# EasyEDA Pro project osc_gener.eprj, schematic 示波发生

## Sheets
1 主板＋ad: Create Date: 2025-03-17; Page Name: 主板＋ad; Project Name: osc_gener; Schematic Name: 示波发生; Update Date: 2026-05-22; Company: 嘉立创EDA; Page Size: A4; Version: V1.0
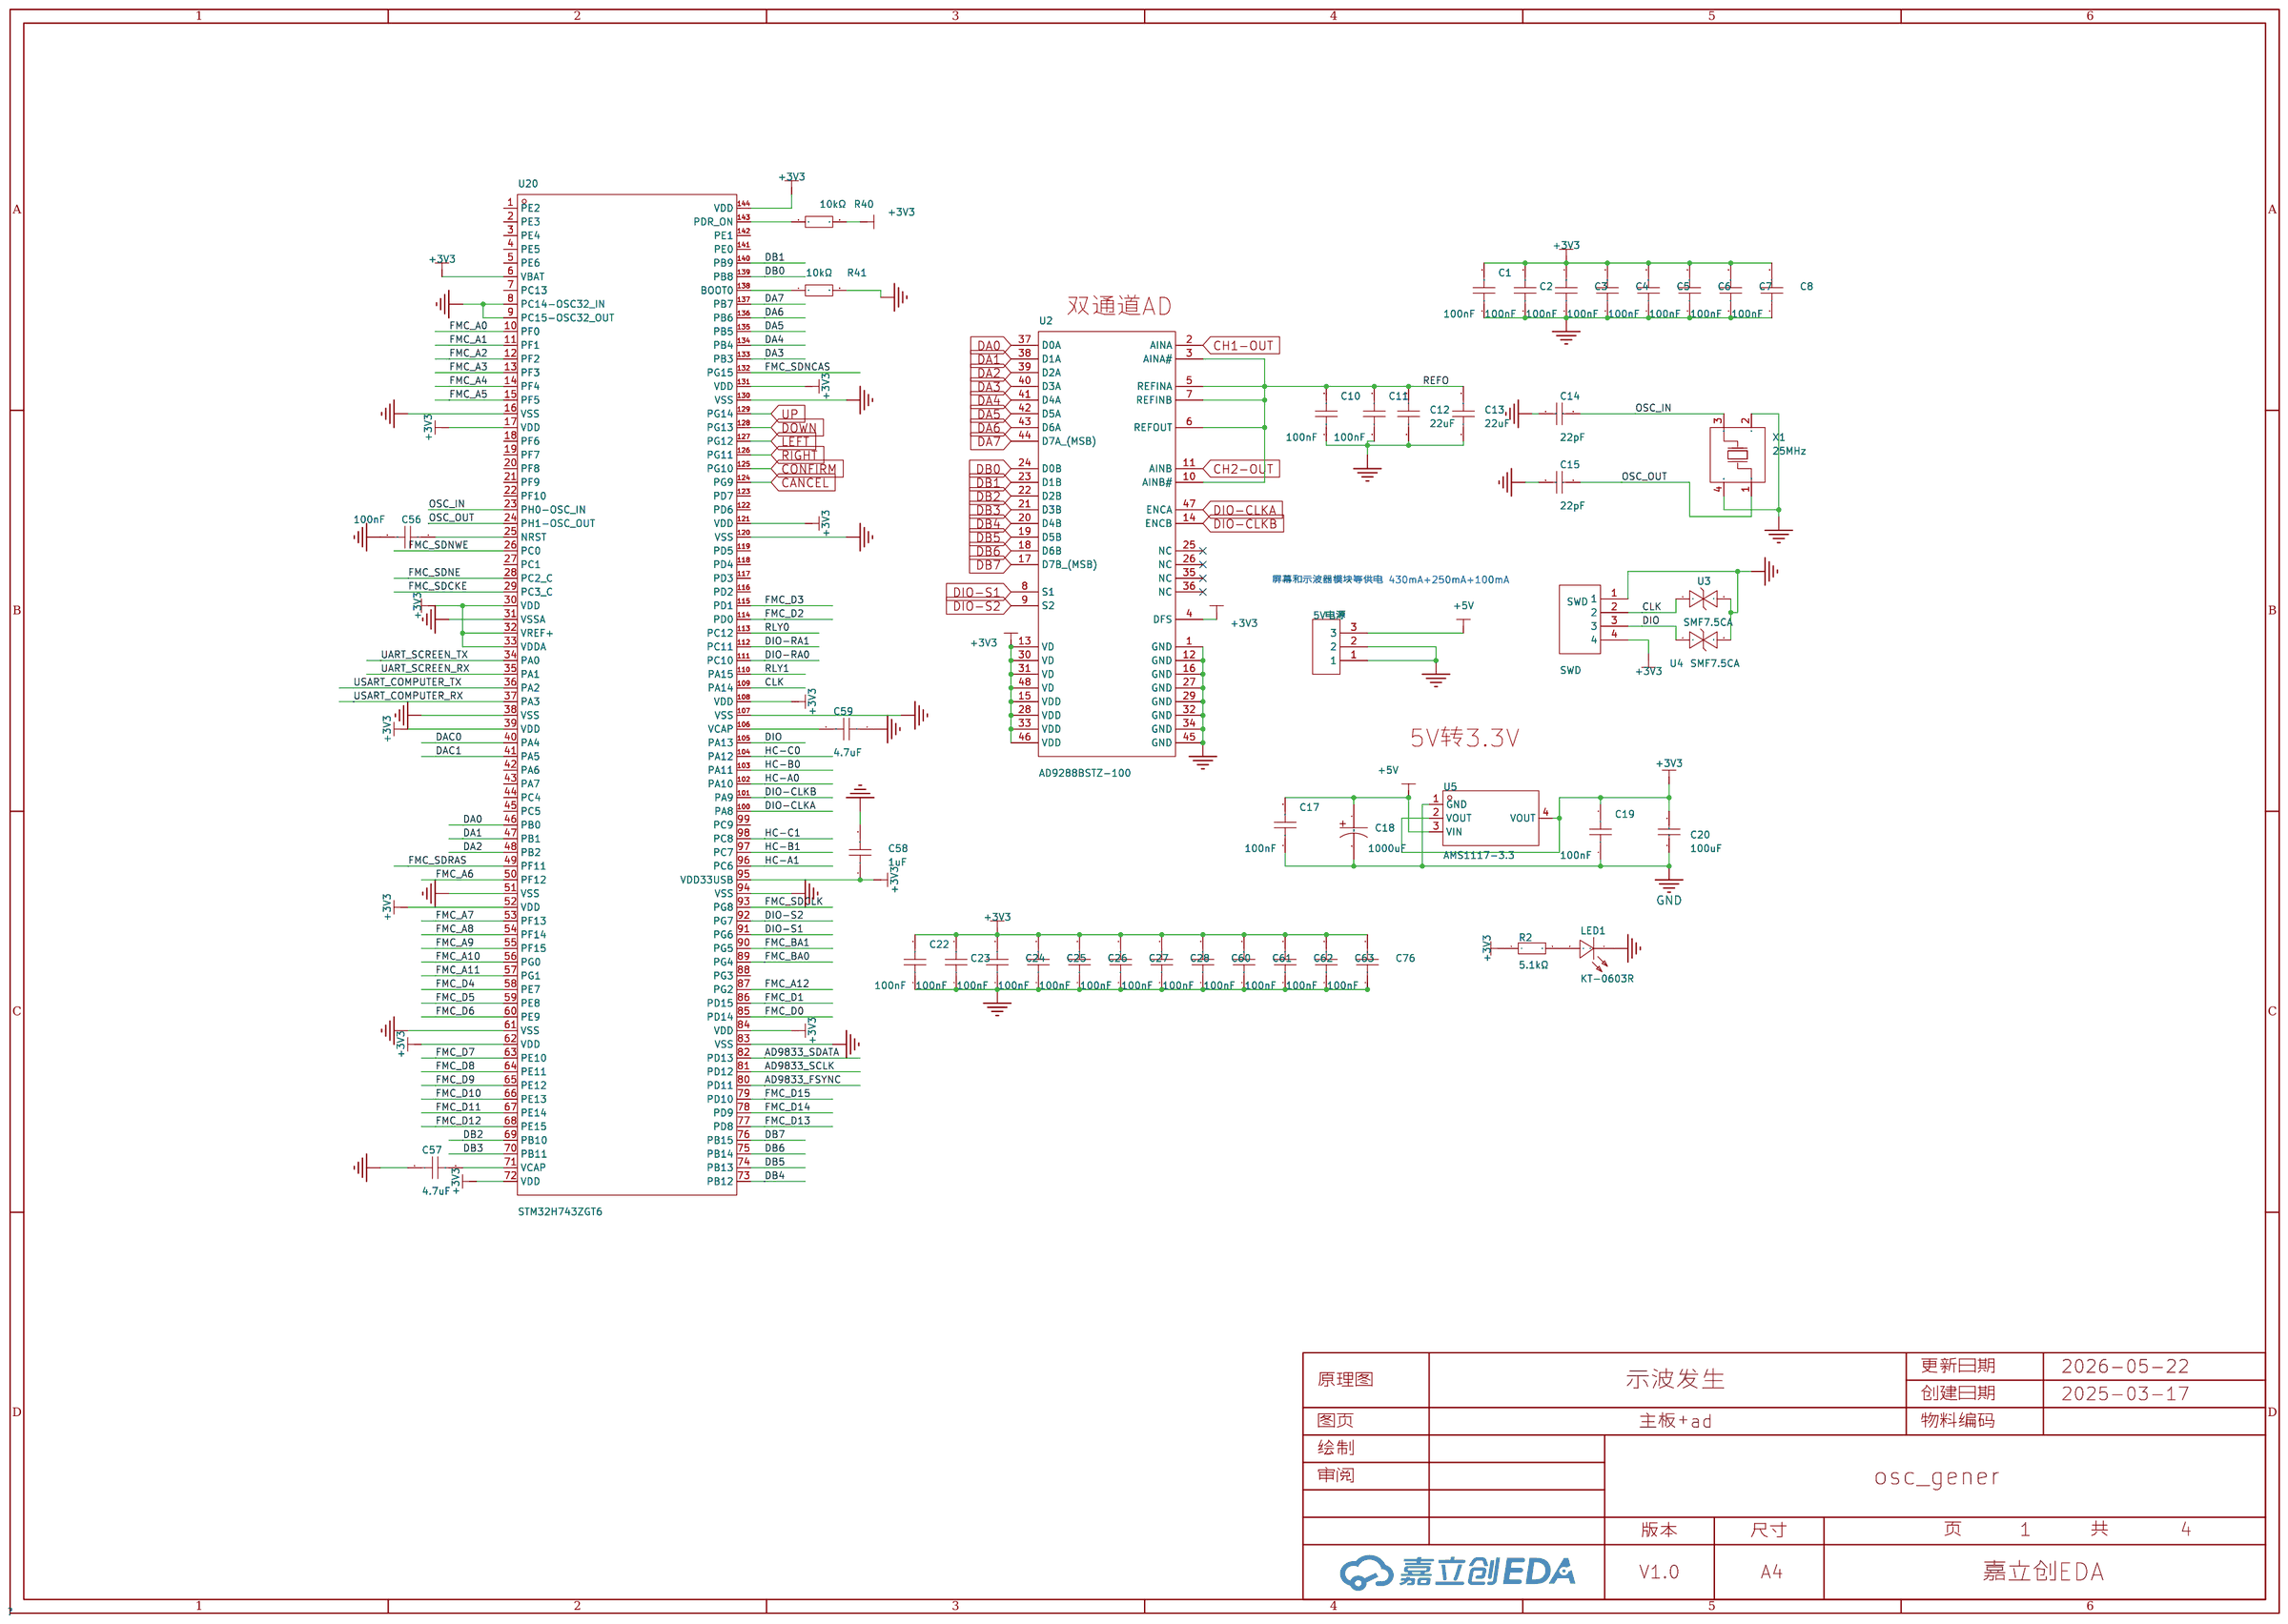
[diagram p0: 主板＋ad]
2 插座: Page Name: 插座
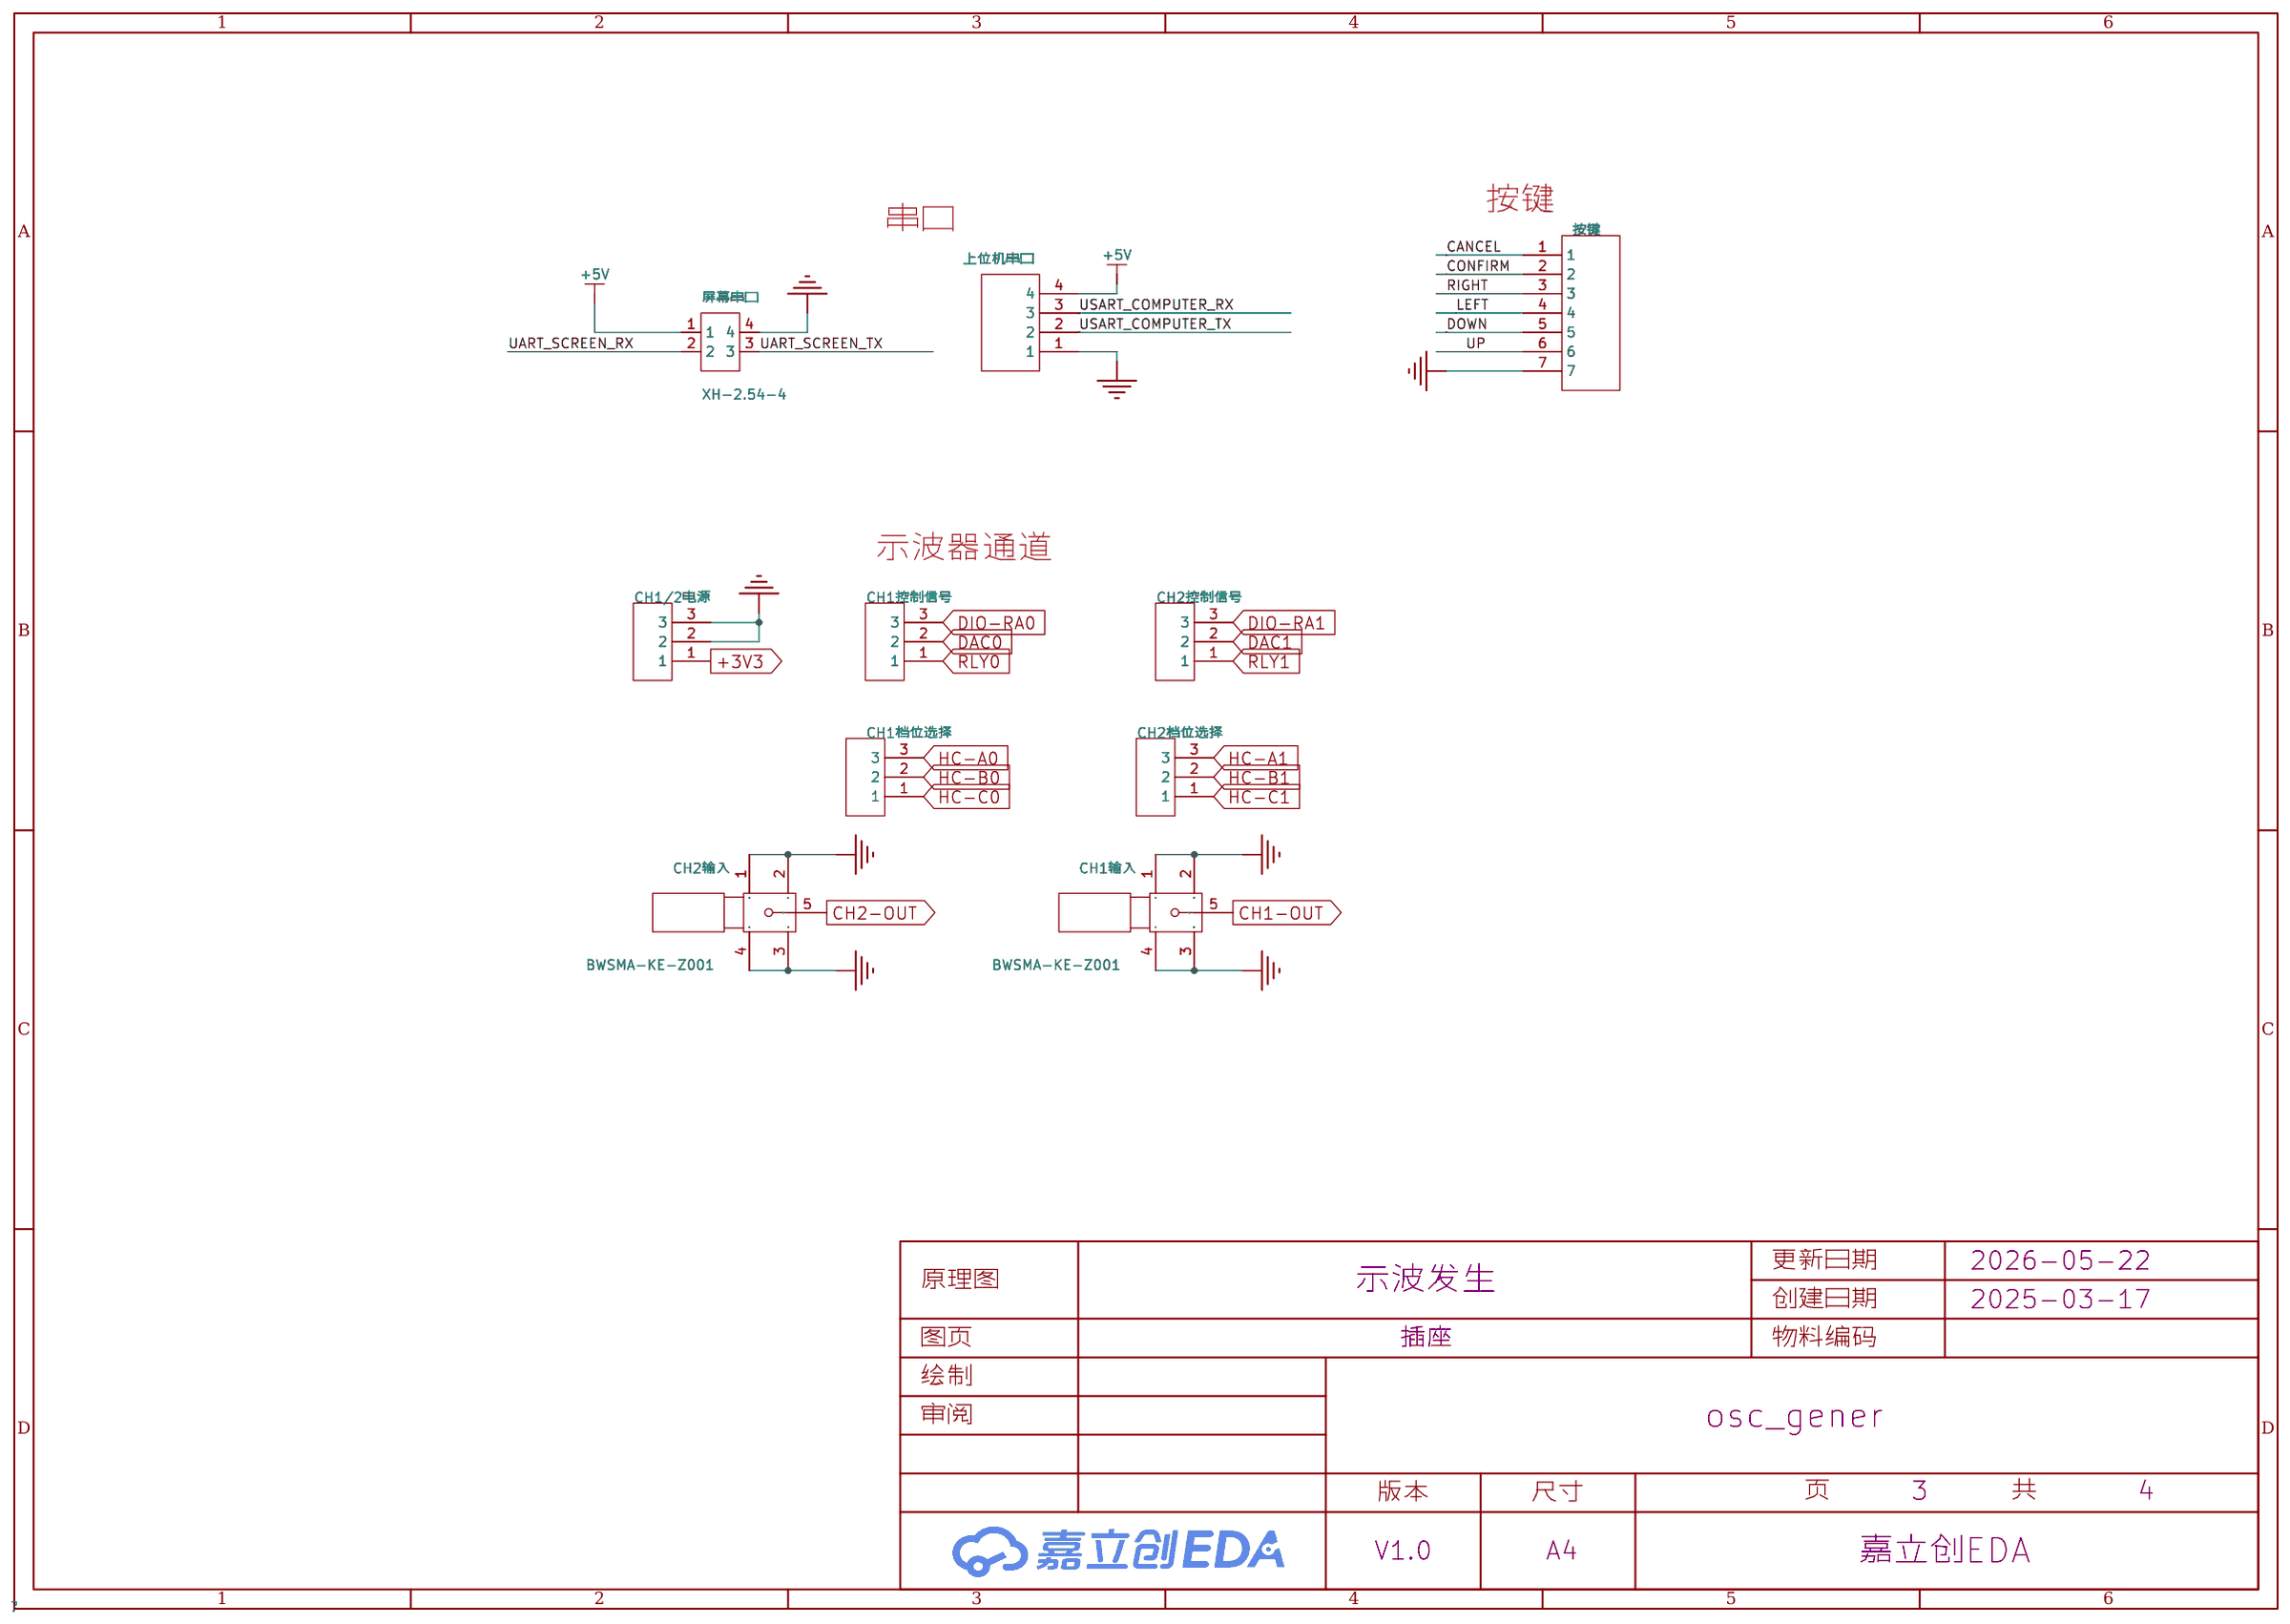
[diagram p1: 插座]
3 信号发生器: Page Name: 信号发生器
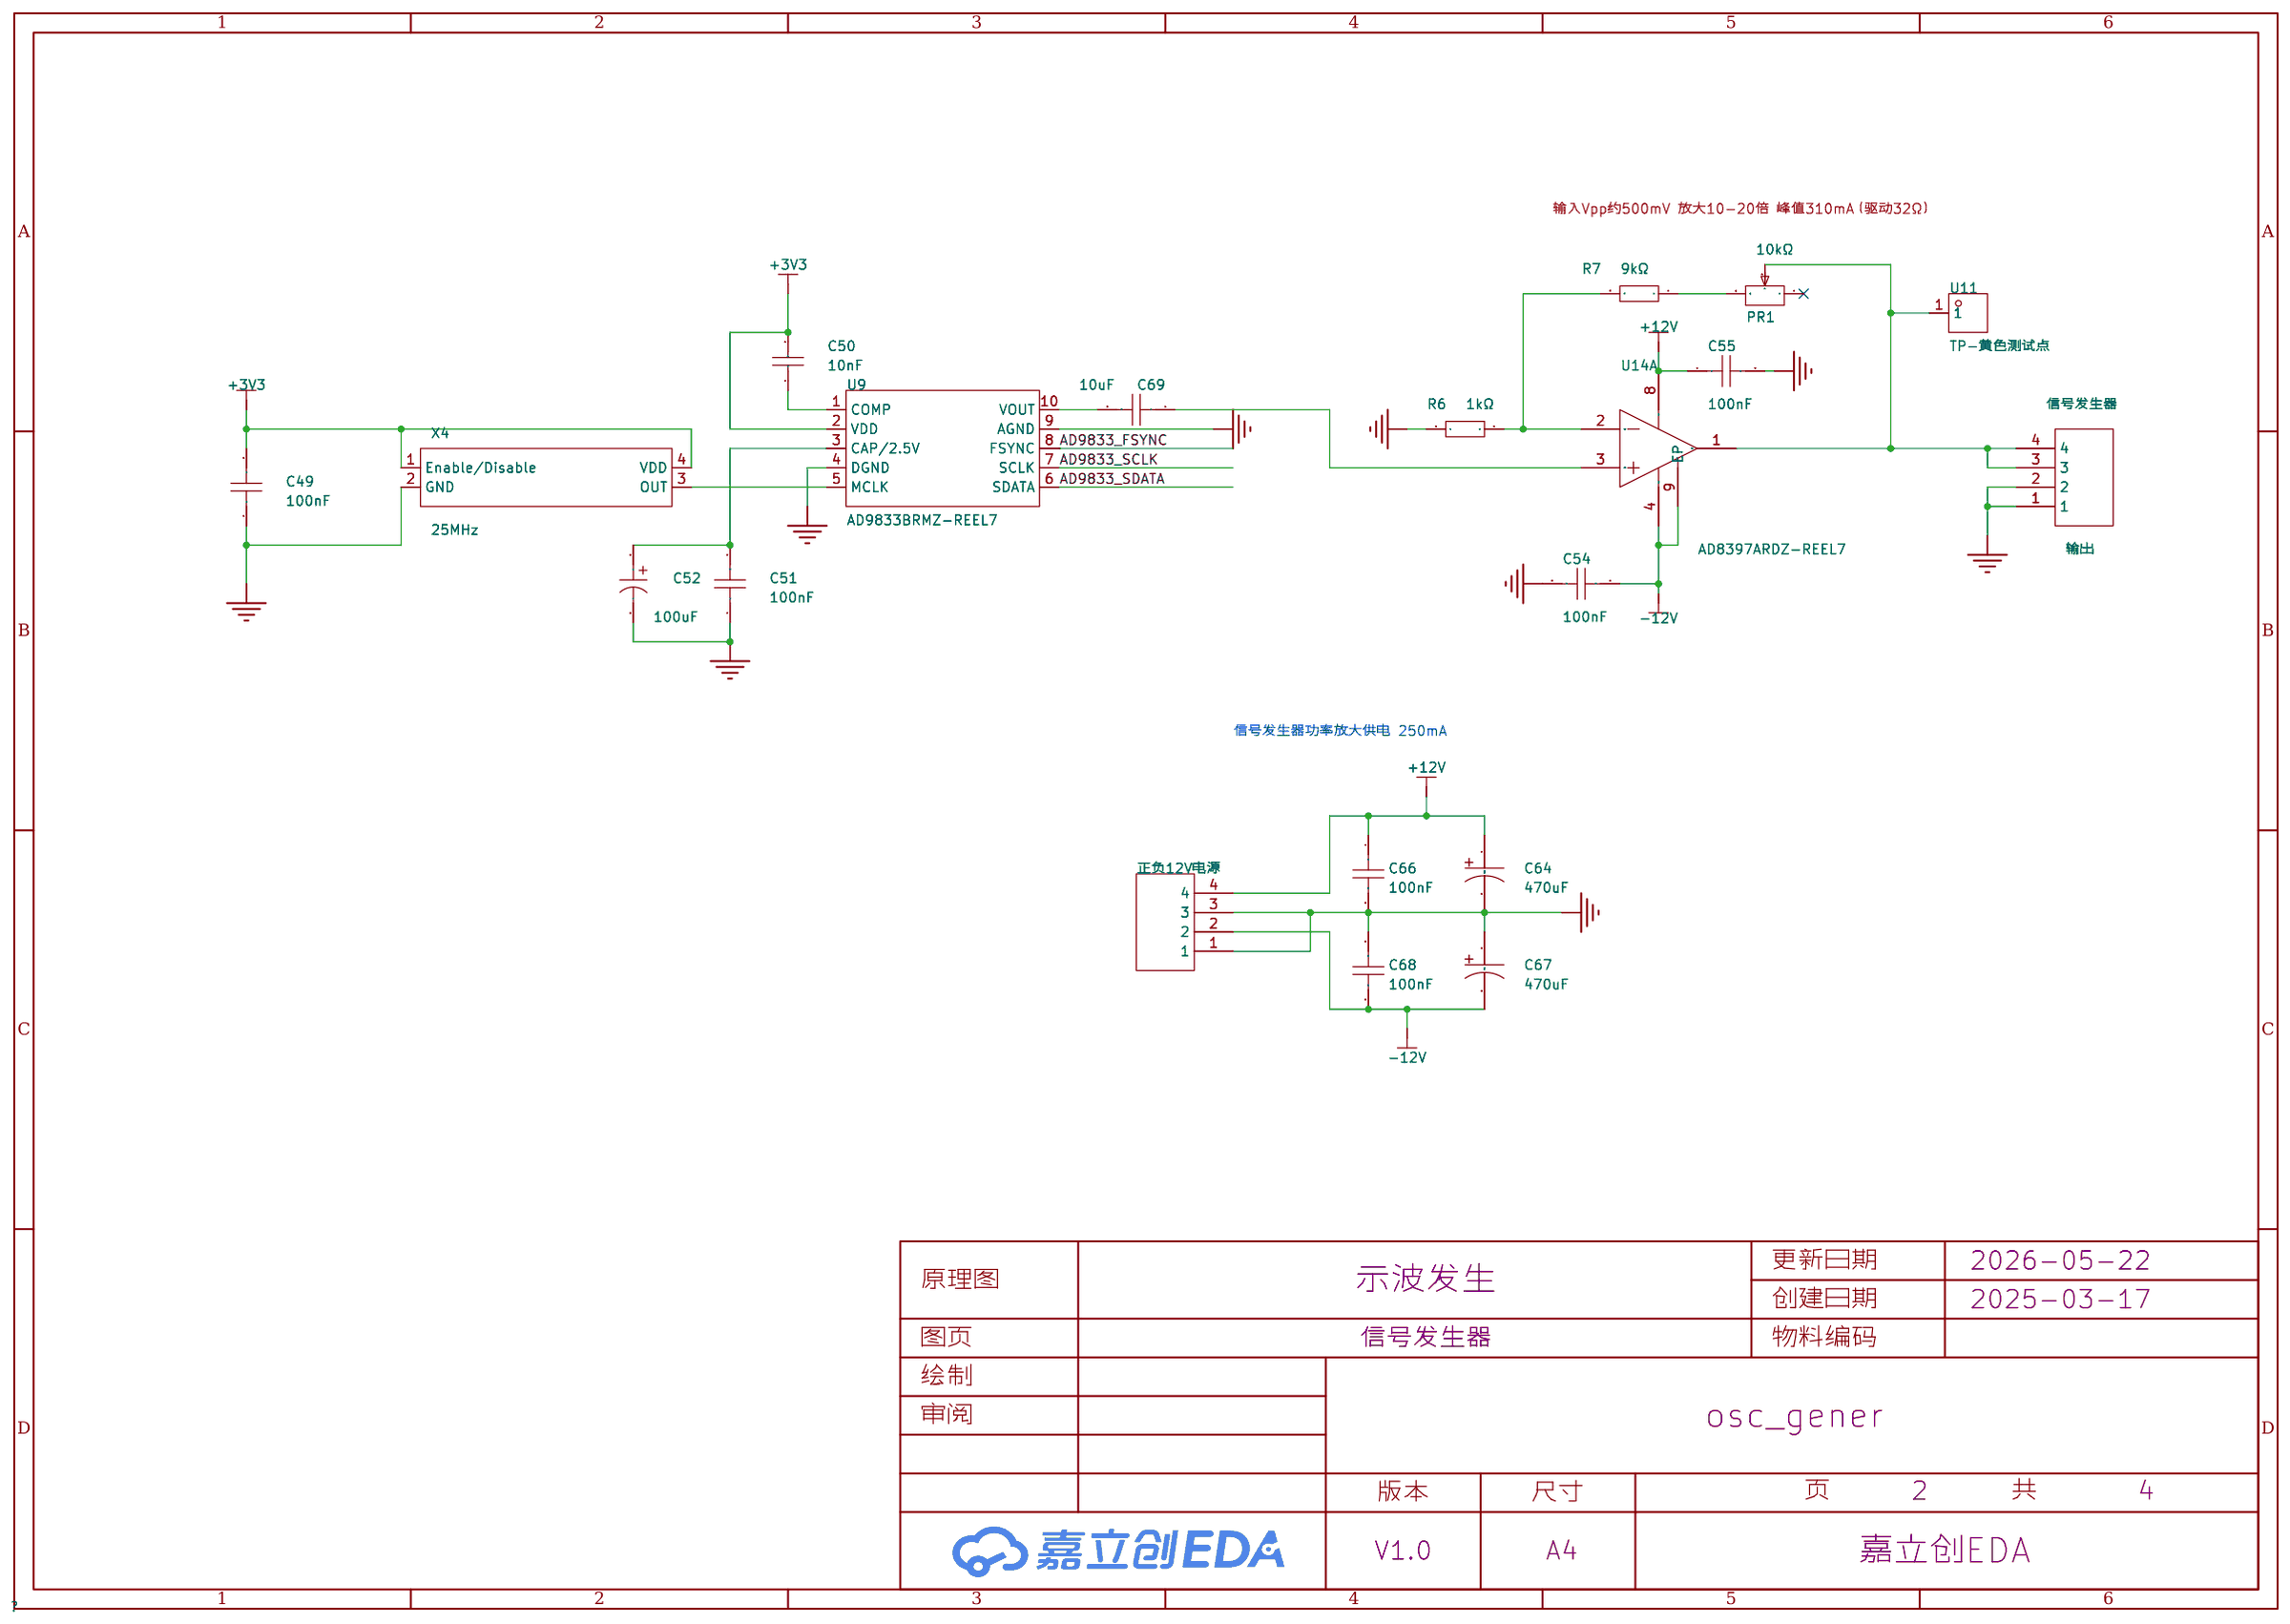
[diagram p2: 信号发生器]
4 SDRAM: Create Date: 2026-05-21; Page Name: SDRAM.示波发生; Update Date: 2026-05-21
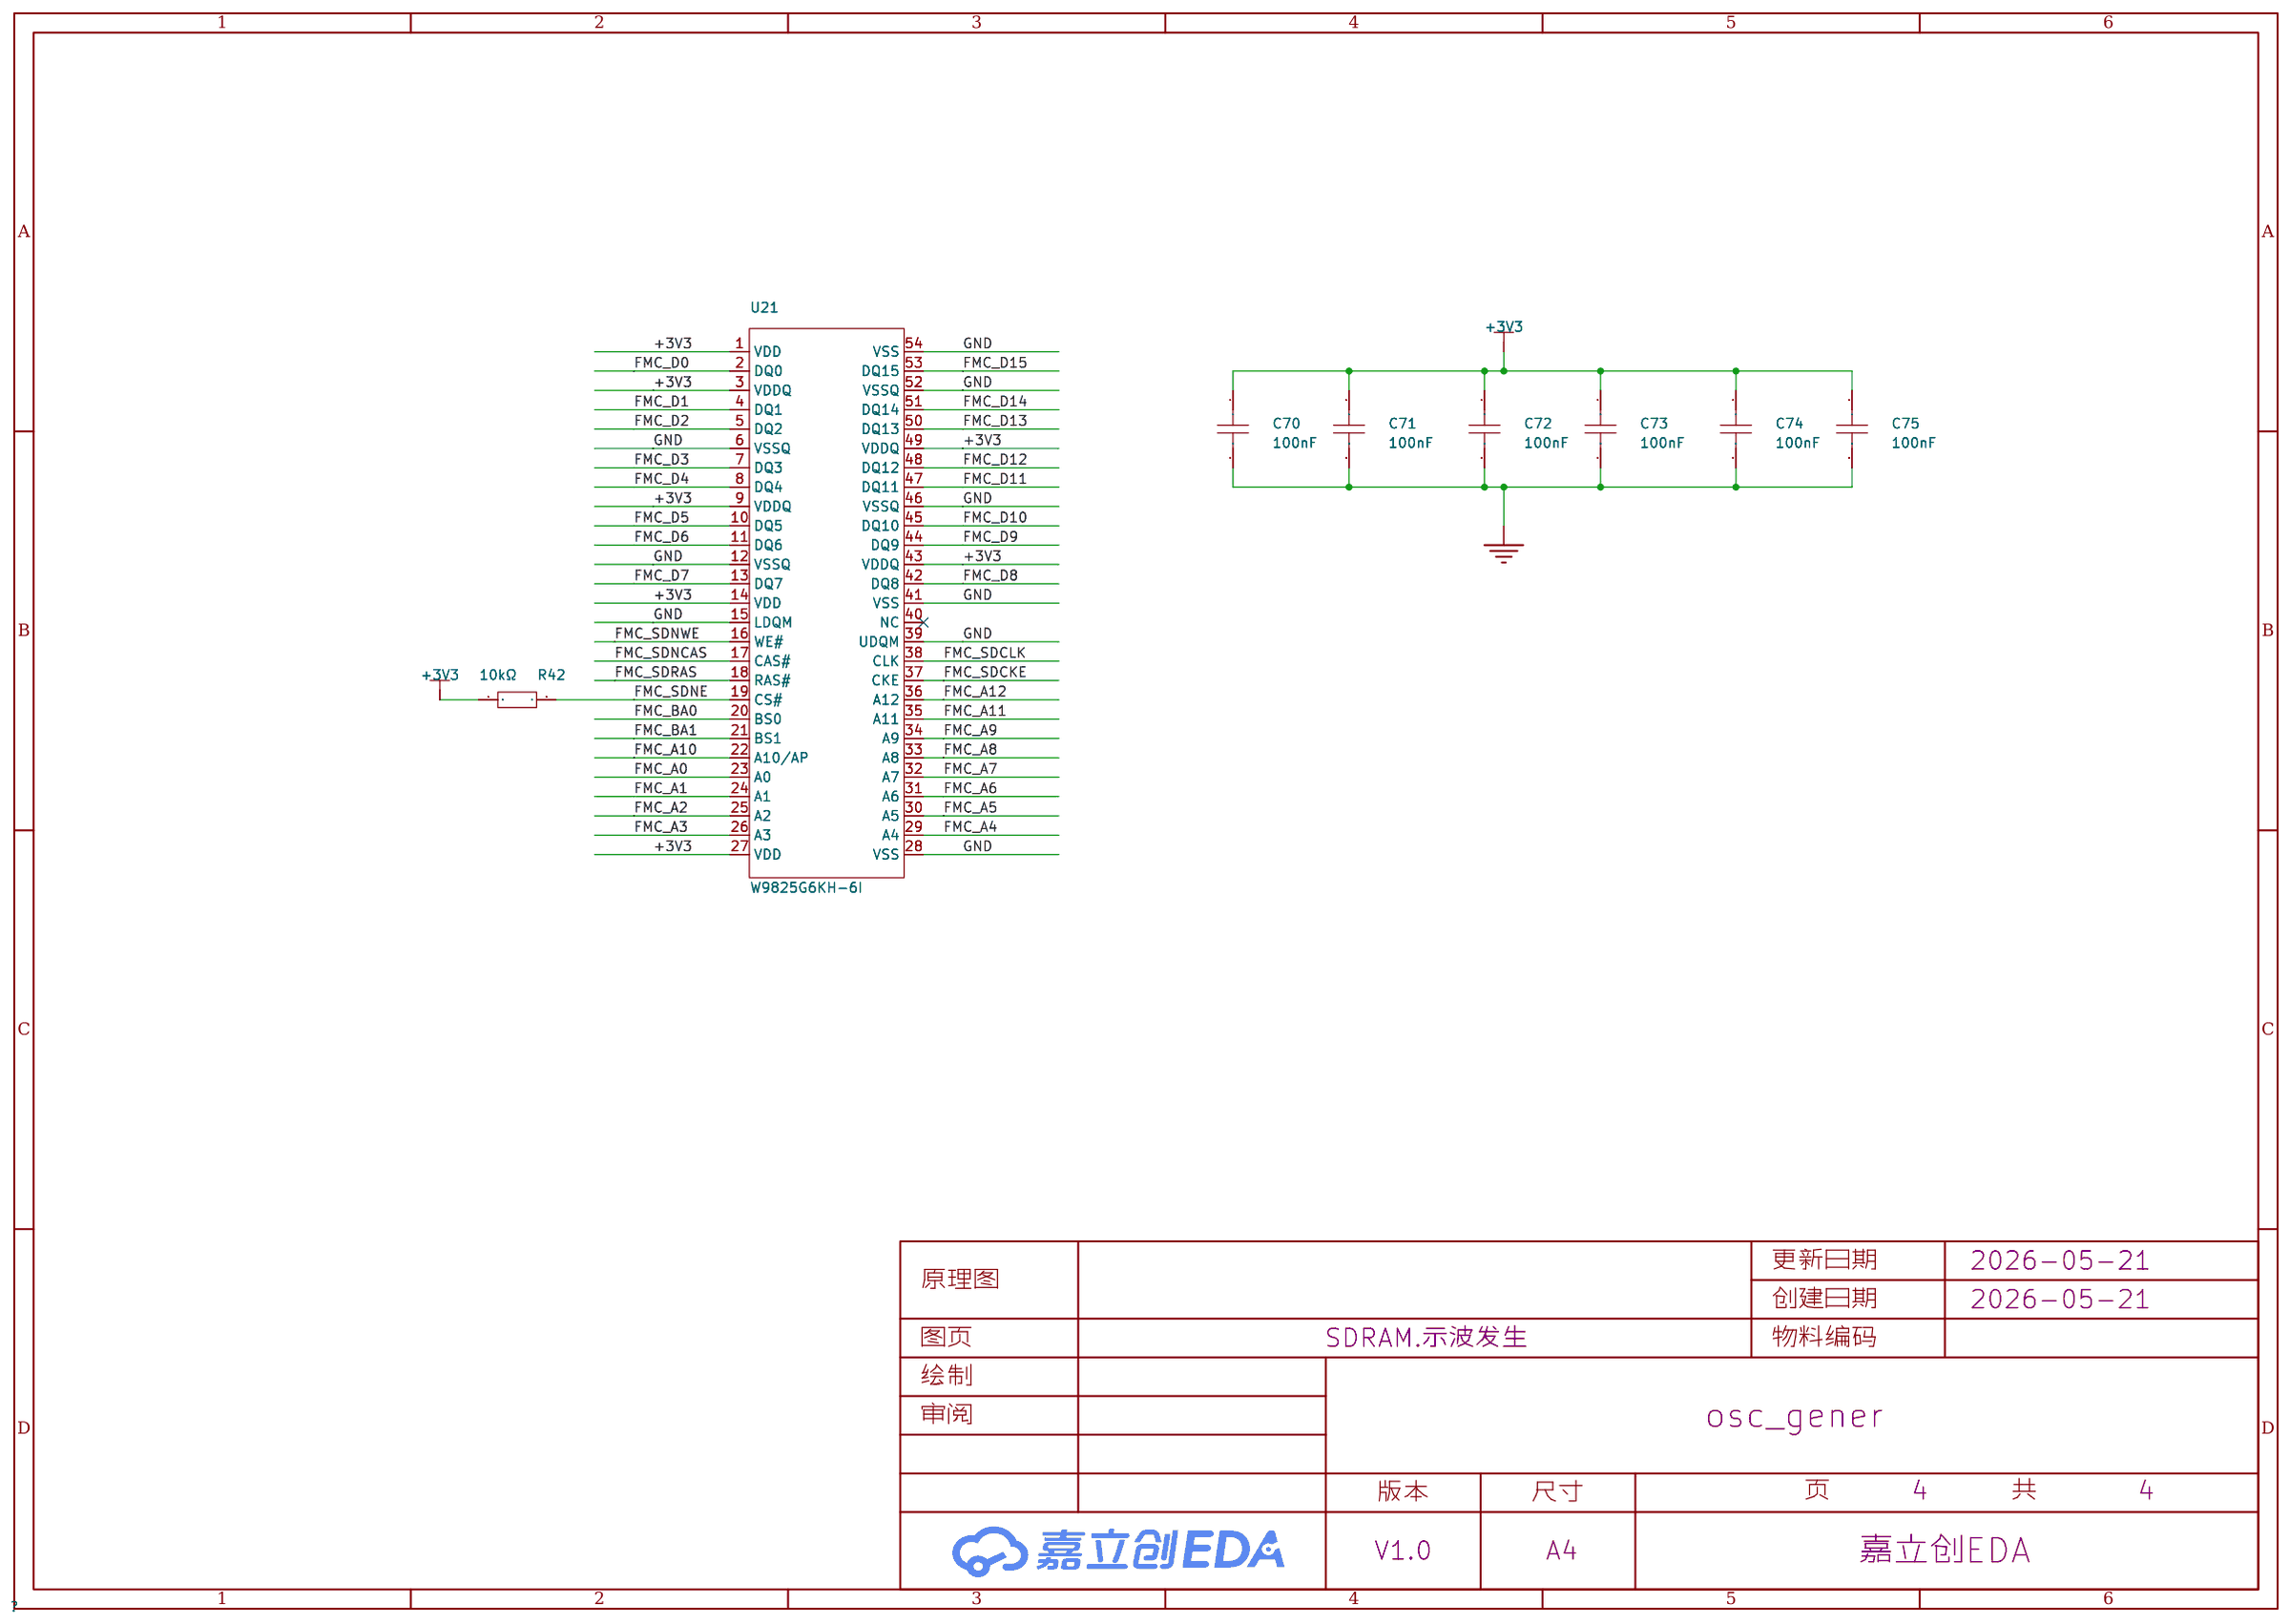
[diagram p3: SDRAM]

## Parts
sheet SDRAM
C70  100nF  [C0402]
C71  100nF  [C0402]
C72  100nF  [C0402]
C73  100nF  [C0402]
C74  100nF  [C0402]
C75  100nF  [C0402]
R42  10kΩ  [R0402]
U21  W9825G6KH-6I  [TSOP-54_L22.2-W10.2-P0.80-LS11.8-BL]
sheet 主板＋ad
5V电源  -  [CH2.54-3插座]
C1  100nF  [C0402]
C2  100nF  [C0402]
C3  100nF  [C0402]
C4  100nF  [C0402]
C5  100nF  [C0402]
C6  100nF  [C0402]
C7  100nF  [C0402]
C8  100nF  [C0402]
C10  100nF  [C0402]
C11  100nF  [C0402]
C12  22uF  [C0603]
C13  22uF  [C0603]
C14  22pF  [C0603]
C15  22pF  [C0603]
C17  100nF  [C0402]
C18  1000uF  [cap-th_bd8.0-p3.50-d0.6-fd_1]
C19  100nF  [C0402]
C20  100uF  [C1206]
C22  100nF  [C0402]
C23  100nF  [C0402]
C24  100nF  [C0402]
C25  100nF  [C0402]
C26  100nF  [C0402]
C27  100nF  [C0402]
C28  100nF  [C0402]
C56  100nF  [C0402]
C57  4.7uF  [C0603]
C58  1uF  [C0603]
C59  4.7uF  [C0603]
C60  100nF  [C0402]
C61  100nF  [C0402]
C62  100nF  [C0402]
C63  100nF  [C0402]
C76  100nF  [C0402]
LED1  KT-0603R  [LED0603-RD]
R2  5.1kΩ  [R0603]
R40  10kΩ  [R0402]
R41  10kΩ  [R0402]
SWD  SWD  [CH2.54-4插座]
U2  AD9288BSTZ-100  [LQFP-48_L7.0-W7.0-P0.50-LS9.0-BL]
U3  SMF7.5CA  [SOD-123FL_L2.8-W1.8-LS3.7-BI]
U4  SMF7.5CA  [SOD-123FL_L2.8-W1.8-LS3.7-BI]
U5  AMS1117-3.3  [SOT-223-3_L6.5-W3.4-P2.30-LS7.0-BR]
U20  STM32H743ZGT6  [LQFP-144_L20.0-W20.0-P0.50-LS22.0-BL]
X1  25MHz  [OSC-SMD_4P-L3.2-W2.5-BL]
sheet 信号发生器
C49  100nF  [C0603]
C50  10nF  [C0603]
C51  100nF  [C0603]
C52  100uF  [CAP-TH_BD8.0-P3.50-D0.6-FD_1]
C54  100nF  [C0603]
C55  100nF  [C0603]
C64  470uF  [cap-th_bd8.0-p3.50-d0.6-fd_1]
C66  100nF  [C0402]
C67  470uF  [cap-th_bd8.0-p3.50-d0.6-fd_1]
C68  100nF  [C0402]
C69  10uF  [CAP-TH_L5.0-W5.0-P2.54-D1.0]
PR1  10kΩ  [RES-ADJ-TH_3P-L9.5-W4.9-P2.50]
R6  1kΩ  [240*80mil]
R7  9kΩ  [240*80mil]
U9  AD9833BRMZ-REEL7  [MSOP-10_L3.0-W3.0-P0.50-LS5.0-BL]
U11  TP-黄色测试点  [TESTPOINT-TH_BD3.2]
U14  AD8397ARDZ-REEL7  [SOP-8_L4.9-W3.9-P1.27-LS6.0-BL-EP2.1]  (section 1)
X4  25MHz  [OSC-SMD_4P-L3.2-W2.5-BL]
信号发生器  输出  [CH2.54-4插座]
正负12V电源  -  [CH2.54-4插座]
sheet 插座
CH1/2电源  -  [CH2.54-3插座]
CH1控制信号  -  [CH2.54-3插座]
CH1档位选择  -  [CH2.54-3插座]
CH1输入  BWSMA-KE-Z001  [SMA-TH_BWSMA-KE-Z001]
CH2控制信号  -  [CH2.54-3插座]
CH2档位选择  -  [CH2.54-3插座]
CH2输入  BWSMA-KE-Z001  [SMA-TH_BWSMA-KE-Z001]
上位机串口  -  [CH2.54-4插座]
屏幕串口  XH-2.54-4  [CONN-TH_XH-2.54-4]
按键  -  [CH2.54-7插座]

## Library data of the parts
C1-C8 C10 C11 C17 C19 C22-C28 C56 C60-C63 C66 C68 C70-C76 = CL05B104KB54PNC: 容值:100nF;精度:±10%;额定电压:50V;材质(温度系数):X7R;; LCSC Part Name: 100nF ±10% 50V; Supplier Part: C307331; Manufacturer: SAMSUNG(三星); Supplier Footprint: 0402; JLCPCB Part Class: 基础库; Datasheet: https://atta.szlcsc.com/upload/public/pdf/source/20160218/1457707763339.pdf; Supplier: LCSC; Tolerance: ±10%; Voltage Rated: 50V; Temperature Coefficient: X7R
R40-R42 = 0402WGF1002TCE: 电阻类型:厚膜电阻;阻值:10kΩ;精度:±1%;功率:62.5mW;最大工作电压:50V;温度系数:±100ppm/℃;; LCSC Part Name: 10kΩ ±1% 62.5mW 厚膜电阻; Supplier Part: C25744; Manufacturer: UNI-ROYAL(厚声); Supplier Footprint: 0402; JLCPCB Part Class: 基础库; Datasheet: https://atta.szlcsc.com/upload/public/pdf/source/20200306/C422600_1E6D84923E4A46A82E41ADD87F860B5C.pdf; Supplier: LCSC; Type: 厚膜电阻; Tolerance: ±1%; Power(Watts): 62.5mW; Overload Voltage (Max): 50V; Temperature Coefficient: ±100ppm/℃; Operating Temperature Range: -55℃~+155℃
U21 = W9825G6KH-6I: 存储容量:256Mbit;时钟频率(fc):166MHz;; LCSC Part Name: 4M×4存储体×16位SDRAM; Supplier Part: C97572; Manufacturer: Winbond(华邦); Supplier Footprint: TSOPII-54-10.2mm; Datasheet: https://item.szlcsc.com/datasheet/W9825G6KH-6I/98780.html; Supplier: LCSC; Memory Size: 256Mbit; Clock Frequency: 166MHz; Voltage - Supply: 3V~3.6V; Operating Temperature: -40℃~+85℃
5V电源 CH1/2电源 CH1控制信号 CH1档位选择 CH2控制信号 CH2档位选择 = HDR-3P
C12 C13 = CL10A226MQ8NRNC: 容值:22uF;精度:±20%;额定电压:6.3V;材质(温度系数):X5R;; LCSC Part Name: 22uF ±20% 6.3V; Supplier Part: C59461; Manufacturer: SAMSUNG(三星); Supplier Footprint: 0603; Datasheet: https://atta.szlcsc.com/upload/public/pdf/source/20160218/1457707763339.pdf; Supplier: LCSC; Tolerance: ±20%; Voltage Rated: 6.3V; Temperature Coefficient: X5R
C14 C15 = CL10C220JB8NNNC: 容值:22pF;精度:±5%;额定电压:50V;材质(温度系数):C0G;; LCSC Part Name: 22pF ±5% 50V; Supplier Part: C1653; Manufacturer: SAMSUNG(三星); Supplier Footprint: 0603; JLCPCB Part Class: 基础库; Datasheet: https://atta.szlcsc.com/upload/public/pdf/source/20160218/1457707763339.pdf; Supplier: LCSC; Tolerance: ±5%; Voltage Rated: 50V; Temperature Coefficient: C0G
C18 C64 C67 = RVT1A471M0607_C335982: 容值:470uF;精度:±20%;额定电压:10V;纹波电流:200mA@120Hz;等效串联电阻:-;; LCSC Part Name: 470uF ±20% 10V; Supplier Part: C335982; Manufacturer: ROQANG(容强); Manufacturer Part: RVT1A471M0607; Supplier Footprint: SMD,D6.3xL7.7mm; Datasheet: https://atta.szlcsc.com/upload/public/pdf/source/20181128/C335987_23CA7AA50FB42690DF736C43FE112376.pdf; Supplier: LCSC; Tolerance: ±20%; Rated Voltage: 10V; Ripple Current: 200mA@120Hz; φD: 6.3mm; L: 7.7mm; Lifetime @ Temp: 2000hrs@105℃; Operating Temperature: -40℃~+105℃
C20 = CL31A107MQHNNNE: 容值:100uF;精度:±20%;额定电压:6.3V;材质(温度系数):X5R;; LCSC Part Name: 100uF ±20% 6.3V; Supplier Part: C15008; Manufacturer: SAMSUNG(三星); Supplier Footprint: 1206; Datasheet: https://atta.szlcsc.com/upload/public/pdf/source/20160218/1457707763339.pdf; Supplier: LCSC; Tolerance: ±20%; Voltage Rated: 6.3V; Temperature Coefficient: X5R
C57 C59 = CL10A475KO8NNNC: 容值:4.7uF;精度:±10%;额定电压:16V;温度系数:X5R;; LCSC Part Name: 4.7uF ±10% 16V; Supplier Part: C19666; Manufacturer: SAMSUNG(三星); Supplier Footprint: 0603; Datasheet: https://item.szlcsc.com/datasheet/CL10A475KO8NNNC/20375.html; Supplier: LCSC; Tolerance: ±10%; Voltage Rating: 16V; Temperature Coefficient: X5R
C58 = CL10A105KB8NNNC: 容值:1uF;精度:±10%;额定电压:50V;温度系数:X5R;; LCSC Part Name: 1uF ±10% 50V; Supplier Part: C15849; Manufacturer: SAMSUNG(三星); Supplier Footprint: 0603; Datasheet: https://item.szlcsc.com/datasheet/CL10A105KB8NNNC/16531.html; Supplier: LCSC; Tolerance: ±10%; Voltage Rating: 50V; Temperature Coefficient: X5R
LED1 = KT-0603R: 发光颜色:红色;功率:-;正向电流:-;主波长:-;二极管配置:-;透镜颜色:-;色温:-;发光角度:-;载带方式:-;工作温度:-40℃~+85℃;; LCSC Part Name: 0603 红灯 高亮; Supplier Part: C2286; Manufacturer: KENTO; Supplier Footprint: 0603; JLCPCB Part Class: 基础库; Datasheet: https://atta.szlcsc.com/upload/public/pdf/source/20160616/1466072038404.pdf; Supplier: LCSC; Emitted Color: 红色; Operating Temperature: -40℃~+85℃
R2 = 0603WAF5101T5E: 电阻类型:厚膜电阻;阻值:5.1kΩ;精度:±1%;功率:100mW;最大工作电压:75V;温度系数:±100ppm/℃;; LCSC Part Name: 5.1kΩ ±1% 100mW 厚膜电阻; Supplier Part: C23186; Manufacturer: UNI-ROYAL(厚声); Supplier Footprint: 0603; Datasheet: https://atta.szlcsc.com/upload/public/pdf/source/20200306/C422600_1E6D84923E4A46A82E41ADD87F860B5C.pdf; Supplier: LCSC; Type: 厚膜电阻; Tolerance: ±1%; Power(Watts): 100mW; Overload Voltage (Max): 75V; Temperature Coefficient: ±100ppm/℃; Operating Temperature Range: -55℃~+155℃
SWD 上位机串口 信号发生器 正负12V电源 = HDR-4P
U2 = AD9288BSTZ-100: 接口:并行;电源电压:2.7V~3.6V;采样率:100MHz;分辨率:8位;; Supplier Part: C31151; Manufacturer: ADI(亚德诺); Supplier Footprint: LQFP-48(7x7); JLCPCB Part Class: 扩展库; Datasheet: https://atta.szlcsc.com/upload/public/pdf/source/20140508/1457707057464.pdf; Supplier: LCSC; Interface: 并行; differential input: 是; number of channels: 2; Supply Voltage: 2.7V~3.6V; sampling frequency: 100MHz; resolution: 8位; Operating Temperature: -40℃~+85℃
U3 U4 = SMF7.5CA_C19077503: 极性:双向;反向截止电压(Vrwm):7.5V;最大钳位电压:12.9V;峰值脉冲电流(Ipp)@10/1000us:15.5A;峰值脉冲功率(Ppp)@10/1000us:200W;击穿电压:9.21V;; Supplier Part: C19077503; Manufacturer: 宏迦橙; Supplier Footprint: SOD-123FL; Datasheet: https://atta.szlcsc.com/upload/public/pdf/source/20231129/4813F17DC56F8B344A8D004597B3633C.pdf; Supplier: LCSC; polarity: 双向; Reverse Stand-Off Voltage (Vrwm): 7.5V; Maximum Clamping Voltage: 12.9V; Peak Pulse Current (Ipp)@10/1000us: 15.5A; Peak Pulse Power Dissipation (Ppp)@10/1000us: 200W; Breakdown Voltage: 9.21V; Reverse Leakage Current (Ir): 50uA; Operating Temperature: -55℃~+155℃; Type: TVS
U5 = AMS1117-3.3_C6186: 输出类型:固定;最大输入电压:-;输出电压:3.3V;最大输出电流:1A;电源纹波抑制比(PSRR):72dB@(120Hz);输出极性:正极;; LCSC Part Name: 输出3.3V 1A; Supplier Part: C6186; Manufacturer: AMS; Supplier Footprint: SOT-223; Datasheet: https://atta.szlcsc.com/upload/public/pdf/source/20180727/C6186_7A095716F0823C02F1997A905E26C086.pdf; Supplier: LCSC; Output Type: 固定; Output Voltage: 3.3V; MAX Output Current: 1A; Power Supply Rejection Ratio (PSRR): 72dB@(120Hz); Dropout Voltage: 1.3V@(800mA); Output Polarity: 正极; Number of Outputs: 1
U20 = STM32H743ZGT6: CPU内核:ARM Cortex-M7;CPU最大主频:480MHz;CPU位数:32 Bit;; LCSC Part Name: 带DSP和DP-FPU的高性能ARM Cortex-M7 MCU，具有1 MB Flash、1 MB RAM、480 MHz CPU、一级缓存、外部存储器接口、JPEG编解码器和大量外设; Supplier Part: C730184; Manufacturer: ST(意法半导体); Supplier Footprint: LQFP-144(20x20); JLCPCB Part Class: 扩展库; Datasheet: https://item.szlcsc.com/datasheet/STM32H743ZGT6/778139.html; Supplier: LCSC; CPU Core: ARM Cortex-M7; CPU Maximum Speed: 480MHz; Core Size: 32 Bit; Program Storage Size: 1MB; Program Memory Type: FLASH; RAM Size: 1MB; Number of I/O: 114; ADC (Bit): 16bit; DAC (Bit): 12bit; Oscillator Type: 内置; Voltage - Supply: 1.62V~3.6V; Operating Temperature: -40℃~+85℃
X1 = X322525MOB4SI: 晶振类型:贴片晶振;频率:25MHz;常温频差:±10ppm;外接负载电容:12pF;频率稳定度(全温):±20ppm;; LCSC Part Name: 25MHz ±10ppm 12pF; Supplier Part: C9006; Manufacturer: YXC(扬兴晶振); Supplier Footprint: SMD3225-4P; Datasheet: https://atta.szlcsc.com/upload/public/pdf/source/20240329/19D5F850207469550BEB00D7DFEDBC7A.pdf; Supplier: LCSC; Crystal Type: 贴片晶振; Normal temperature Frequency Tolerance: ±10ppm; External load capacitor: 12pF; Frequency Stability(Full temperature range): ±20ppm; Operating Temperature: -40℃~+85℃
C49 C51 C54 C55 = CC0603KRX7R9BB104: 容值:100nF;精度:±10%;额定电压:50V;温度系数:X7R;; LCSC Part Name: 100nF ±10% 50V; Supplier Part: C14663; Manufacturer: YAGEO(国巨); Supplier Footprint: 0603; JLCPCB Part Class: 基础库; Datasheet: https://item.szlcsc.com/datasheet/CC0603KRX7R9BB104/15331.html; Supplier: LCSC; Tolerance: ±10%; Voltage Rated: 50V; Temperature Coefficient: X7R; Voltage Rating: 50V
C50 = 0603B103K500NT: 容值:10nF;精度:±10%;额定电压:50V;温度系数:X7R;; LCSC Part Name: 10nF ±10% 50V; Supplier Part: C57112; Manufacturer: FH(风华); Supplier Footprint: 0603; JLCPCB Part Class: 基础库; Datasheet: https://item.szlcsc.com/datasheet/0603B103K500NT/58143.html; Supplier: LCSC; Tolerance: ±10%; Voltage Rated: 50V; Temperature Coefficient: X7R; Voltage Rating: 50V
C52 = 100uF: Supplier Part: C9900016884; Supplier Footprint: CAP-TH_BD8.0-P3.50-D1.0-FD; JLCPCB Part Class: 扩展库; Supplier: LCSC
C69 = CC1H200KA1PDCH4B3003: 容值:20pF;精度:±10%;额定电压:50V;温度系数:-;; LCSC Part Name: 20pF ±10% 50V; Supplier Part: C353911; Manufacturer: Dersonic(德尔创); Supplier Footprint: 插件,P=2.54mm; JLCPCB Part Class: 扩展库; Datasheet: https://atta.szlcsc.com/upload/public/pdf/source/20190830/C377848_24D90F56C29E23BEA1E89C3CB5766CA0.pdf; Supplier: LCSC; Tolerance: ±10%; Voltage Rated: 50V; Lead Spacing: 2.54mm
PR1 = 环保 3296W-1-503LF: 阻值:-;功率:-;; LCSC Part Name: 50KΩ; Supplier Part: C5033; Supplier Footprint: VR-3296W; JLCPCB Part Class: 扩展库; Supplier: LCSC
R6 R7 = 插件电阻
U9 = AD9833BRMZ-REEL7: 自宽调谐(最大值):-;; Supplier Part: C515887; Supplier Footprint: MSOP-10; JLCPCB Part Class: 扩展库; Supplier: LCSC
U11 = TP-黄色测试点: Supplier Part: C9900007422; Supplier Footprint: TESTPOINT-TH_BD-2P-P2.00; JLCPCB Part Class: 扩展库; Supplier: LCSC
U14 = AD8397ARDZ-REEL7: 放大器数:2;轨到轨:轨到轨输出;增益带宽积(GBW):69MHz;输入失调电压(Vos):3mV;压摆率(SR):53V/us;输入偏置电流(Ib):900nA;; LCSC Part Name: 双通道轨到轨输出运算放大器; Supplier Part: C90876; Manufacturer: ADI(亚德诺); Supplier Footprint: SOIC-8-EP; JLCPCB Part Class: 扩展库; Datasheet: https://item.szlcsc.com/datasheet/AD8397ARDZ-REEL7/92064.html; Supplier: LCSC; Number of Channels: 2; Maximum Power Supply Range (Vdd-Vss): 24V; Rail to Rail: 轨到轨输出; Gain Bandwidth Product: 69MHz; Vos - Input Offset Voltage: 3mV; Slew Rate: 53V/us; Ib - Input Bias Current: 900nA; Input Offset Current(Ios): 50nA; Input Voltage Noise Density: 4.5nV/√Hz@100kHz; Common Mode Rejection Ratio(CMRR): 96dB; Quiescent Current: 7mA; Output Current: 310mA; Operating Temperature: -40℃~+85℃; Single supply: 3V~24V; Dual Supply: 1.5V~12.6V；-12.6V~-1.5V
X4 = OT322525MJBA4SL: 频率:25MHz;常温频差:±10ppm;输出模式:CMOS;工作电压:1.8V~3.3V;工作电流:5mA;频率稳定度:±20ppm;; LCSC Part Name: YSO110TR 25MHZ 1.8V-3.3V ±10PPM -40~85℃（±20PPM) CMOS; Supplier Part: C669088; Manufacturer: YXC(扬兴晶振); Supplier Footprint: SMD3225-4P; Datasheet: https://item.szlcsc.com/datasheet/OT322525MJBA4SL/699188.html; Supplier: LCSC; Normal temperature Frequency Tolerance: ±10ppm; Output Type: CMOS; Voltage - Supply: 1.8V~3.3V; Current - Supply: 5mA; Frequency Stability: ±20ppm; Operating Temperature: -40℃~+85℃
CH1输入 CH2输入 = BWSMA-KE-Z001_C496549: 连接器类型:板端;接口类型:内孔;端口数量:1;接口直径:-;接口长度/高度:-;频率-最大值:-;射频系列:SMA;阻抗:50Ω;样式:正脚;触头材质:-;触头镀层:-;工作温度范围:-65℃~+165℃;焊接温度(最大值):-;; LCSC Part Name: 内孔 SMA 正脚; Supplier Part: C496549; Manufacturer: BAT WIRELESS(蝙蝠无线); Supplier Footprint: 插件; Datasheet: https://atta.szlcsc.com/upload/public/pdf/source/20221228/40BF41E56A06003A0210E1785CA66EA6.pdf; Supplier: LCSC; Connector Type: 板端; Interface Type: 内孔; Number of Ports: 1; RF Series: SMA; Impedance: 50Ω; Style: 正脚; Operating Temperature Range: -65℃~+165℃
屏幕串口 = XH-2.54-4: Supplier Part: C9900005230; JLCPCB Part Class: 扩展库; Supplier: LCSC
按键 = HDR-7P

## Nets
+3V3: C1.2 C2.2 C3.2 C4.2 C5.2 C6.2 C7.2 C8.2 C19.2 C20.2 C22.2 C23.2 C24.2 C25.2 C26.2 C27.2 C28.2 C49.2 C50.2 C58.1 C60.2 C61.2 C62.2 C63.2 C70.1 C71.1 C72.1 C73.1 C74.1 C75.1 C76.2 CH1/2电源.1 R2.1 R40.2 R42.1 SWD.4 U2.4(DFS) U2.13(VD) U2.15(VDD) U2.28(VDD) U2.30(VD) U2.31(VD) U2.33(VDD) U2.46(VDD) U2.48(VD) U5.2(VOUT) U5.4(VOUT) U9.2(VDD) U20.6(VBAT) U20.17(VDD) U20.30(VDD) U20.32(VREF+) U20.33(VDDA) U20.39(VDD) U20.52(VDD) U20.62(VDD) U20.72(VDD) U20.84(VDD) U20.95(VDD33USB) U20.108(VDD) U20.121(VDD) U20.131(VDD) U20.144(VDD) U21.1(VDD) U21.3(VDDQ) U21.9(VDDQ) U21.14(VDD) U21.27(VDD) U21.43(VDDQ) U21.49(VDDQ) X4.1(Enable/Disable) X4.4(VDD)
+5V: 5V电源.3 C17.2 C18.1 U5.3(VIN) 上位机串口.4 屏幕串口.1
+12V: C55.1 C64.1 C66.1 U14.8(VDD) 正负12V电源.4
-12V: C54.1 C67.2 C68.2 U14.4(VSS) U14.9(EP) 正负12V电源.2
GND: 5V电源.1 5V电源.2 C1.1 C2.1 C3.1 C4.1 C5.1 C6.1 C7.1 C8.1 C10.1 C11.1 C12.1 C13.1 C14.1 C15.1 C17.1 C18.2 C19.1 C20.1 C22.1 C23.1 C24.1 C25.1 C26.1 C27.1 C28.1 C49.1 C51.1 C52.2 C54.2 C55.2 C56.2 C57.1 C58.2 C59.1 C60.1 C61.1 C62.1 C63.1 C64.2 C66.2 C67.1 C68.1 C70.2 C71.2 C72.2 C73.2 C74.2 C75.2 C76.1 CH1/2电源.2 CH1/2电源.3 CH1输入.1 CH1输入.2 CH1输入.3 CH1输入.4 CH2输入.1 CH2输入.2 CH2输入.3 CH2输入.4 LED1.1(K) R6.2 R41.2 SWD.1 U2.1(GND) U2.12(GND) U2.16(GND) U2.27(GND) U2.29(GND) U2.32(GND) U2.34(GND) U2.45(GND) U3.2 U4.2 U5.1(GND) U9.4(DGND) U9.9(AGND) U20.8(PC14-OSC32_IN) U20.9(PC15-OSC32_OUT) U20.16(VSS) U20.31(VSSA) U20.38(VSS) U20.51(VSS) U20.61(VSS) U20.83(VSS) U20.94(VSS) U20.107(VSS) U20.120(VSS) U20.130(VSS) U21.6(VSSQ) U21.12(VSSQ) U21.15(LDQM) U21.28(VSS) U21.39(UDQM) U21.41(VSS) U21.46(VSSQ) U21.52(VSSQ) U21.54(VSS) X1.2(GND) X1.4(GND) X4.2(GND) 上位机串口.1 信号发生器.1 信号发生器.2 屏幕串口.4 按键.7 正负12V电源.1 正负12V电源.3
AD9833_FSYNC: U9.8(FSYNC) U20.80(PD11)
AD9833_SCLK: U9.7(SCLK) U20.81(PD12)
AD9833_SDATA: U9.6(SDATA) U20.82(PD13)
CANCEL: U20.124(PG9) 按键.1
CH1-OUT: CH1输入.5 U2.2(AINA)
CH2-OUT: CH2输入.5 U2.11(AINB)
CLK: SWD.2 U3.1 U20.109(PA14)
CONFIRM: U20.125(PG10) 按键.2
DA0: U2.37(D0A) U20.46(PB0)
DA1: U2.38(D1A) U20.47(PB1)
DA2: U2.39(D2A) U20.48(PB2)
DA3: U2.40(D3A) U20.133(PB3)
DA4: U2.41(D4A) U20.134(PB4)
DA5: U2.42(D5A) U20.135(PB5)
DA6: U2.43(D6A) U20.136(PB6)
DA7: U2.44(D7A (MSB)) U20.137(PB7)
DAC0: CH1控制信号.2 U20.40(PA4)
DAC1: CH2控制信号.2 U20.41(PA5)
DB0: U2.24(D0B) U20.139(PB8)
DB1: U2.23(D1B) U20.140(PB9)
DB2: U2.22(D2B) U20.69(PB10)
DB3: U2.21(D3B) U20.70(PB11)
DB4: U2.20(D4B) U20.73(PB12)
DB5: U2.19(D5B) U20.74(PB13)
DB6: U2.18(D6B) U20.75(PB14)
DB7: U2.17(D7B (MSB)) U20.76(PB15)
DIO: SWD.3 U4.1 U20.105(PA13)
DIO-CLKA: U2.47(ENCA) U20.100(PA8)
DIO-CLKB: U2.14(ENCB) U20.101(PA9)
DIO-RA0: CH1控制信号.3 U20.111(PC10)
DIO-RA1: CH2控制信号.3 U20.112(PC11)
DIO-S1: U2.8(S1) U20.91(PG6)
DIO-S2: U2.9(S2) U20.92(PG7)
DOWN: U20.128(PG13) 按键.5
FMC_A0: U20.10(PF0) U21.23(A0)
FMC_A1: U20.11(PF1) U21.24(A1)
FMC_A2: U20.12(PF2) U21.25(A2)
FMC_A3: U20.13(PF3) U21.26(A3)
FMC_A4: U20.14(PF4) U21.29(A4)
FMC_A5: U20.15(PF5) U21.30(A5)
FMC_A6: U20.50(PF12) U21.31(A6)
FMC_A7: U20.53(PF13) U21.32(A7)
FMC_A8: U20.54(PF14) U21.33(A8)
FMC_A9: U20.55(PF15) U21.34(A9)
FMC_A10: U20.56(PG0) U21.22(A10/AP)
FMC_A11: U20.57(PG1) U21.35(A11)
FMC_A12: U20.87(PG2) U21.36(A12)
FMC_BA0: U20.89(PG4) U21.20(BS0)
FMC_BA1: U20.90(PG5) U21.21(BS1)
FMC_D0: U20.85(PD14) U21.2(DQ0)
FMC_D1: U20.86(PD15) U21.4(DQ1)
FMC_D2: U20.114(PD0) U21.5(DQ2)
FMC_D3: U20.115(PD1) U21.7(DQ3)
FMC_D4: U20.58(PE7) U21.8(DQ4)
FMC_D5: U20.59(PE8) U21.10(DQ5)
FMC_D6: U20.60(PE9) U21.11(DQ6)
FMC_D7: U20.63(PE10) U21.13(DQ7)
FMC_D8: U20.64(PE11) U21.42(DQ8)
FMC_D9: U20.65(PE12) U21.44(DQ9)
FMC_D10: U20.66(PE13) U21.45(DQ10)
FMC_D11: U20.67(PE14) U21.47(DQ11)
FMC_D12: U20.68(PE15) U21.48(DQ12)
FMC_D13: U20.77(PD8) U21.50(DQ13)
FMC_D14: U20.78(PD9) U21.51(DQ14)
FMC_D15: U20.79(PD10) U21.53(DQ15)
FMC_SDCKE: U20.29(PC3_C) U21.37(CKE)
FMC_SDCLK: U20.93(PG8) U21.38(CLK)
FMC_SDNCAS: U20.132(PG15) U21.17(CAS#)
FMC_SDNE: R42.2 U20.28(PC2_C) U21.19(CS#)
FMC_SDNWE: U20.26(PC0) U21.16(WE#)
FMC_SDRAS: U20.49(PF11) U21.18(RAS#)
HC-A0: CH1档位选择.3 U20.102(PA10)
HC-A1: CH2档位选择.3 U20.96(PC6)
HC-B0: CH1档位选择.2 U20.103(PA11)
HC-B1: CH2档位选择.2 U20.97(PC7)
HC-C0: CH1档位选择.1 U20.104(PA12)
HC-C1: CH2档位选择.1 U20.98(PC8)
LEFT: U20.127(PG12) 按键.4
OSC_IN: C14.2 U20.23(PH0-OSC_IN) X1.3(OSC2)
OSC_OUT: C15.2 U20.24(PH1-OSC_OUT) X1.1(OSC1)
REFO: C10.2 C11.2 C12.2 C13.2 U2.3(AINA#) U2.5(REFINA) U2.6(REFOUT) U2.7(REFINB) U2.10(AINB#)
RIGHT: U20.126(PG11) 按键.3
RLY0: CH1控制信号.1 U20.113(PC12)
RLY1: CH2控制信号.1 U20.110(PA15)
UART_SCREEN_RX: U20.35(PA1) 屏幕串口.2
UART_SCREEN_TX: U20.34(PA0) 屏幕串口.3
UP: U20.129(PG14) 按键.6
USART_COMPUTER_RX: U20.37(PA3) 上位机串口.3
USART_COMPUTER_TX: U20.36(PA2) 上位机串口.2
$1N2975: LED1.2(A) R2.2
$1N11209: C56.1 U20.25(NRST)
$1N11468: C57.2 U20.71(VCAP)
$1N11827: C59.2 U20.106(VCAP)
$1N12049: R40.1 U20.143(PDR_ON)
$1N12147: R41.1 U20.138(BOOT0)
$3N6846: C50.1 U9.1(COMP)
$3N6849: U9.5(MCLK) X4.3(OUT)
$3N6852: C51.2 C52.1 U9.3(CAP/2.5V)
$3N6863: R6.1 R7.2 U14.2(VINA-)
$3N6867: PR1.3 R7.1
$3N6868: C69.2 U9.10(VOUT)
$3N6869: C69.1 U14.3(VINA+)
Net-(PR1-2): PR1.2 U11.1 U14.1(VOUTA) 信号发生器.3 信号发生器.4

Not connected (* = marked no-connect by the designer): PR1 1*; U2 25(NC)* 26(NC)* 35(NC)* 36(NC)*; U20 1(PE2) 2(PE3) 3(PE4) 4(PE5) 5(PE6) 7(PC13) 18(PF6) 19(PF7) 20(PF8) 21(PF9) 22(PF10) 27(PC1) 42(PA6) 43(PA7) 44(PC4) 45(PC5) 88(PG3) 99(PC9) 116(PD2) 117(PD3) 118(PD4) 119(PD5) 122(PD6) 123(PD7) 141(PE0) 142(PE1); U21 40(NC)*

## Notes on the sheets
sheet 1
- 双通道AD
- 屏幕和示波器模块等供电 430mA+250mA+100mA
- 5V转3.3V
sheet 2
- 按键
- 串口
- 示波器通道
sheet 3
- 输入Vpp约500mV 放大10-20倍 峰值310mA（驱动32Ω）
- 信号发生器功率放大供电 250mA
